# Altium schematic sheet 无线小样.SchDoc
size A2
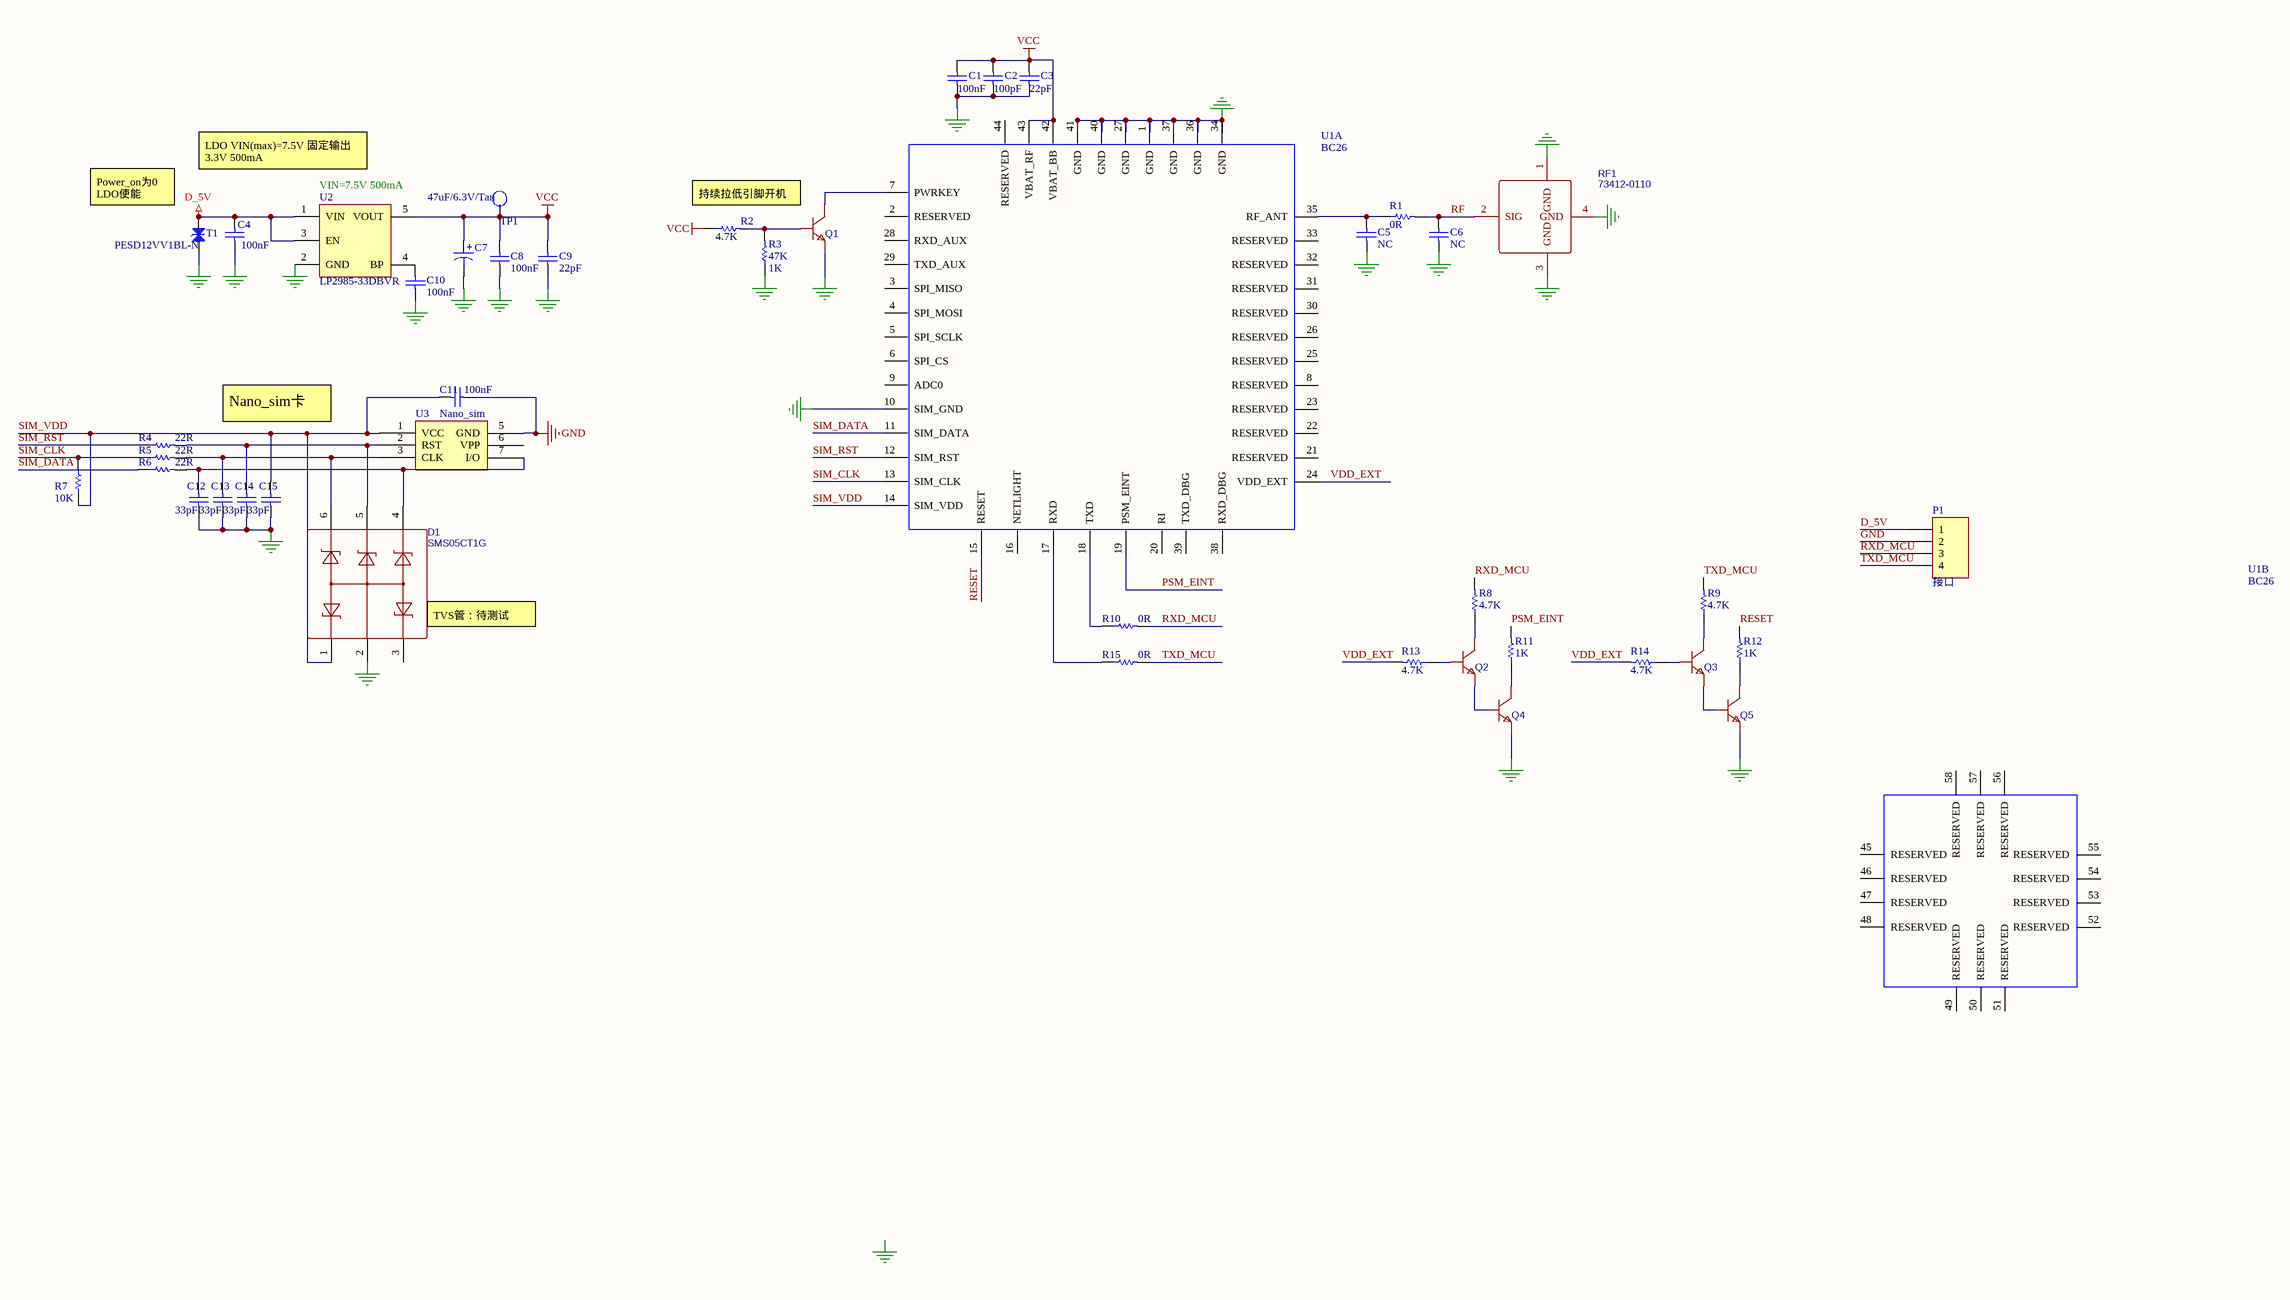
[diagram p0: 无线小样.SchDoc]

## Parts
C1  100nF  [0402C]
C2  100pF  [0402C]
C3  22pF  [0402C]
C4  100nF  [0402C]
C5  NC  [0603C]
C6  NC  [0603C]
C7  47uF/6.3V/Tan  [0402C]
C8  100nF  [0402C]
C9  22pF  [0402C]
C10  100nF  [0402C]
C11  100nF  [0402C]
C12  33pF  [0402C]
C13  33pF  [0402C]
C14  33pF  [0402C]
C15  33pF  [0402C]
D1  SMS05CT1G  [TSOP-6_L3.0-W1.5-P0.95-LS2.8-BL]
P1  接口  [HDR1X4]
Q1  S8050-J3Y  [SOT23]  (value not drawn)
Q2  S8050-J3Y  [SOT23]  (value not drawn)
Q3  S8050-J3Y  [SOT23]  (value not drawn)
Q4  S8050-J3Y  [SOT23]  (value not drawn)
Q5  S8050-J3Y  [SOT23]  (value not drawn)
R1  0R  [0603R]
R2  4.7K  [0402R]
R3  47K  value 1K  [0402R]
R4  22R  [0402R]
R5  22R  [0402R]
R6  22R  [0402R]
R7  10K  [0402R]
R8  4.7K  [0402R]
R9  4.7K  [0402R]
R10  0R  [0402R]
R11  1K  [0402R]
R12  1K  [0402R]
R13  4.7K  [0402R]
R14  4.7K  [0402R]
R15  0R  [0402R]
RF1  73412-0110  [ANT-SMD_73412-0110]
T1  PESD12VV1BL-N  [X1-DFN1006-2_L1.0-W0.6-RD]
TP1  Testpoint  [TP]  (value not drawn)
U1  BC26  [BC26]  (parts A,B of 2)
U2  LP2985-33DBVR  [SOT-23-5]
U3  Nano_sim  [SIM-SMD_C77877]

## Nets
D_5V: C4.1 P1.1 T1.2 U2.1(VIN) U2.3(EN)
GND: C1.1 C2.1 C3.1 C4.2 C5.1 C6.1 C7.2 C8.1 C9.1 C10.1 C11.2 C12.1 C13.1 C14.1 C15.1 D1.2 P1.2 Q1.2(E) Q4.2(E) Q5.2(E) R3.1 RF1.1(GND) RF1.3(GND) RF1.4(GND) T1.1 U1.1(GND) U1.10(SIM_GND) U1.27(GND) U1.34(GND) U1.36(GND) U1.37(GND) U1.40(GND) U1.41(GND) U2.2(GND) U3.5(GND)
VCC: C1.2 C2.2 C3.2 C7.1 C8.2 C9.2 R2.1 TP1.1 U1.42(VBAT_BB) U1.43(VBAT_RF) U2.5(VOUT)
PSM_EINT: R11.2 U1.19(PSM_EINT)
RESET: R12.2 U1.15(RESET)
RF: C6.2 R1.2 RF1.2(SIG)
RXD_MCU: P1.3 R8.2 R10.2
SIM_CLK: R5.1 R7.2 U1.13(SIM_CLK)
SIM_DATA: R6.1 U1.11(SIM_DATA)
SIM_RST: R4.1 U1.12(SIM_RST)
SIM_VDD: C11.1 C15.2 D1.1 R7.1 U1.14(SIM_VDD) U3.1(VCC)
TXD_MCU: P1.4 R9.2 R15.2
VDD_EXT: R13.2 R14.2 U1.24(VDD_EXT)
NetC5_2: C5.2 R1.1 U1.35(RF_ANT)
NetC10_2: C10.2 U2.4(BP)
NetC12_2: C12.2 D1.4 R6.2 U3.7(I/O)
NetC13_2: C13.2 D1.6 R5.2 U3.3(CLK)
NetC14_2: C14.2 D1.5 R4.2 U3.2(RST)
NetQ1_1: Q1.1(B) R2.2 R3.2
NetQ1_3: Q1.3(C) U1.7(PWRKEY)
NetQ2_1: Q2.1(B) R13.1
NetQ2_2: Q2.2(E) Q4.1(B)
NetQ2_3: Q2.3(C) R8.1
NetQ3_1: Q3.1(B) R14.1
NetQ3_2: Q3.2(E) Q5.1(B)
NetQ3_3: Q3.3(C) R9.1
NetQ4_3: Q4.3(C) R11.1
NetQ5_3: Q5.3(C) R12.1
NetR10_1: R10.1 U1.18(TXD)
NetR15_1: R15.1 U1.17(RXD)

Not connected (* = marked no-connect by the designer): D1 3; U1 2(RESERVED) 3(SPI_MISO) 4(SPI_MOSI) 5(SPI_SCLK) 6(SPI_CS) 8(RESERVED) 9(ADC0) 16(NETLIGHT) 20(RI) 21(RESERVED) 22(RESERVED) 23(RESERVED) 25(RESERVED) 26(RESERVED) 28(RXD_AUX) 29(TXD_AUX) 30(RESERVED) 31(RESERVED) 32(RESERVED) 33(RESERVED) 38(RXD_DBG) 39(TXD_DBG) 44(RESERVED) 45(RESERVED) 46(RESERVED) 47(RESERVED) 48(RESERVED) 49(RESERVED) 50(RESERVED) 51(RESERVED) 52(RESERVED) 53(RESERVED) 54(RESERVED) 55(RESERVED) 56(RESERVED) 57(RESERVED) 58(RESERVED); U3 6(VPP)

## Notes on the sheet
- LDO VIN(max)=7.5V 固定输出3.3V 500mA
- (near T1) Power_on为0 LDO使能
- (near U2) VIN=7.5V 500mA
- 持续拉低引脚开机
- Nano_sim卡
- (near D1) TVS管：待测试
- Labels drawn without touching a wire or pin: GND

## Library data of the parts
C1 C3 C5 C6 C8-C15 = Cap: Capacitor; Value: 100pF; Published: 8-Jun-2000; LatestRevisionDate: 17-Jul-2002; LatestRevisionNote: Re-released for DXP Platform.; PackageReference: RAD-0.3; Publisher: Altium Limited; PackageDescription: Radial Cap, Thru-Hole; 2 Leads; 0.3 in Pin Spacing
C2 = Cap: Capacitor; Published: 8-Jun-2000; LatestRevisionDate: 17-Jul-2002; LatestRevisionNote: Re-released for DXP Platform.; PackageReference: RAD-0.3; Publisher: Altium Limited; PackageDescription: Radial Cap, Thru-Hole; 2 Leads; 0.3 in Pin Spacing; Value: 100pF
C4 = Cap: Capacitor; Value: 10uF/16V; Published: 8-Jun-2000; LatestRevisionDate: 17-Jul-2002; LatestRevisionNote: Re-released for DXP Platform.; PackageReference: RAD-0.3; Publisher: Altium Limited; PackageDescription: Radial Cap, Thru-Hole; 2 Leads; 0.3 in Pin Spacing
C7 = Cap Pol1: Polarized Capacitor (Radial); Value: 100pF; Published: 8-Jun-2000; LatestRevisionDate: 17-Jul-2002; LatestRevisionNote: Re-released for DXP Platform.; PackageReference: RB7.6-15; Publisher: Altium Limited; PackageDescription: Polarized Capacitor (Radial); 2 Leads
D1 = SMS05CT1G: BOM_Manufacturer: ON Semicon; Contributor: LCSC; BOM_Supplier: LCSC; BOM_Supplier Part: C233427; BOM_Manufacturer Part: SMS05CT1G; spicePre: D; spiceSymbolName: SMS05CT1G
P1 = Header 4: Header, 4-Pin; LatestRevisionDate: 17-Jul-2002; LatestRevisionNote: Re-released for DXP Platform.; Publisher: Altium Limited
Q1-Q5 = S8050-J3Y: BOM_Manufacturer: (MDD) Jiangsu Yutai Elec; Contributor: LCSC; BOM_Supplier: LCSC; BOM_Supplier Part: C364312; BOM_Manufacturer Part: S8050-J3Y; spicePre: Q
R1 R2 R4-R10 R13-R15 = Res1: Resistor; Value: 1K; Published: 8-Jun-2000; LatestRevisionDate: 17-Jul-2002; LatestRevisionNote: Re-released for DXP Platform.; PackageReference: AXIAL-0.3; Publisher: Altium Limited; PackageDescription: Axial Device, Thru-Hole; 2 Leads; 0.3 in Pin Spacing
R3 R11 R12 = Res1: Resistor; Published: 8-Jun-2000; LatestRevisionDate: 17-Jul-2002; LatestRevisionNote: Re-released for DXP Platform.; PackageReference: AXIAL-0.3; Publisher: Altium Limited; PackageDescription: Axial Device, Thru-Hole; 2 Leads; 0.3 in Pin Spacing
  R11 R12: Value: 1K
RF1 = 73412-0110: BOM_Manufacturer: MOLEX; Contributor: LCSC; BOM_Supplier: LCSC; BOM_Supplier Part: C434806; BOM_Manufacturer Part: 73412-0110; spicePre: R; spiceSymbolName: 73412-0110
T1 = TVS2
U2 = SGM2019
U1 = BC26: Part Description: *; Value: *; Geometry.Height: *; Manufacturer: *; PCB DECAL: *